# EasyEDA schematic SCH_SGU-Ring.json
TITLE: Sheet_1; REV: 1.0; Date: 2022-01-20; Sheet: 1/1; Company: Your Company
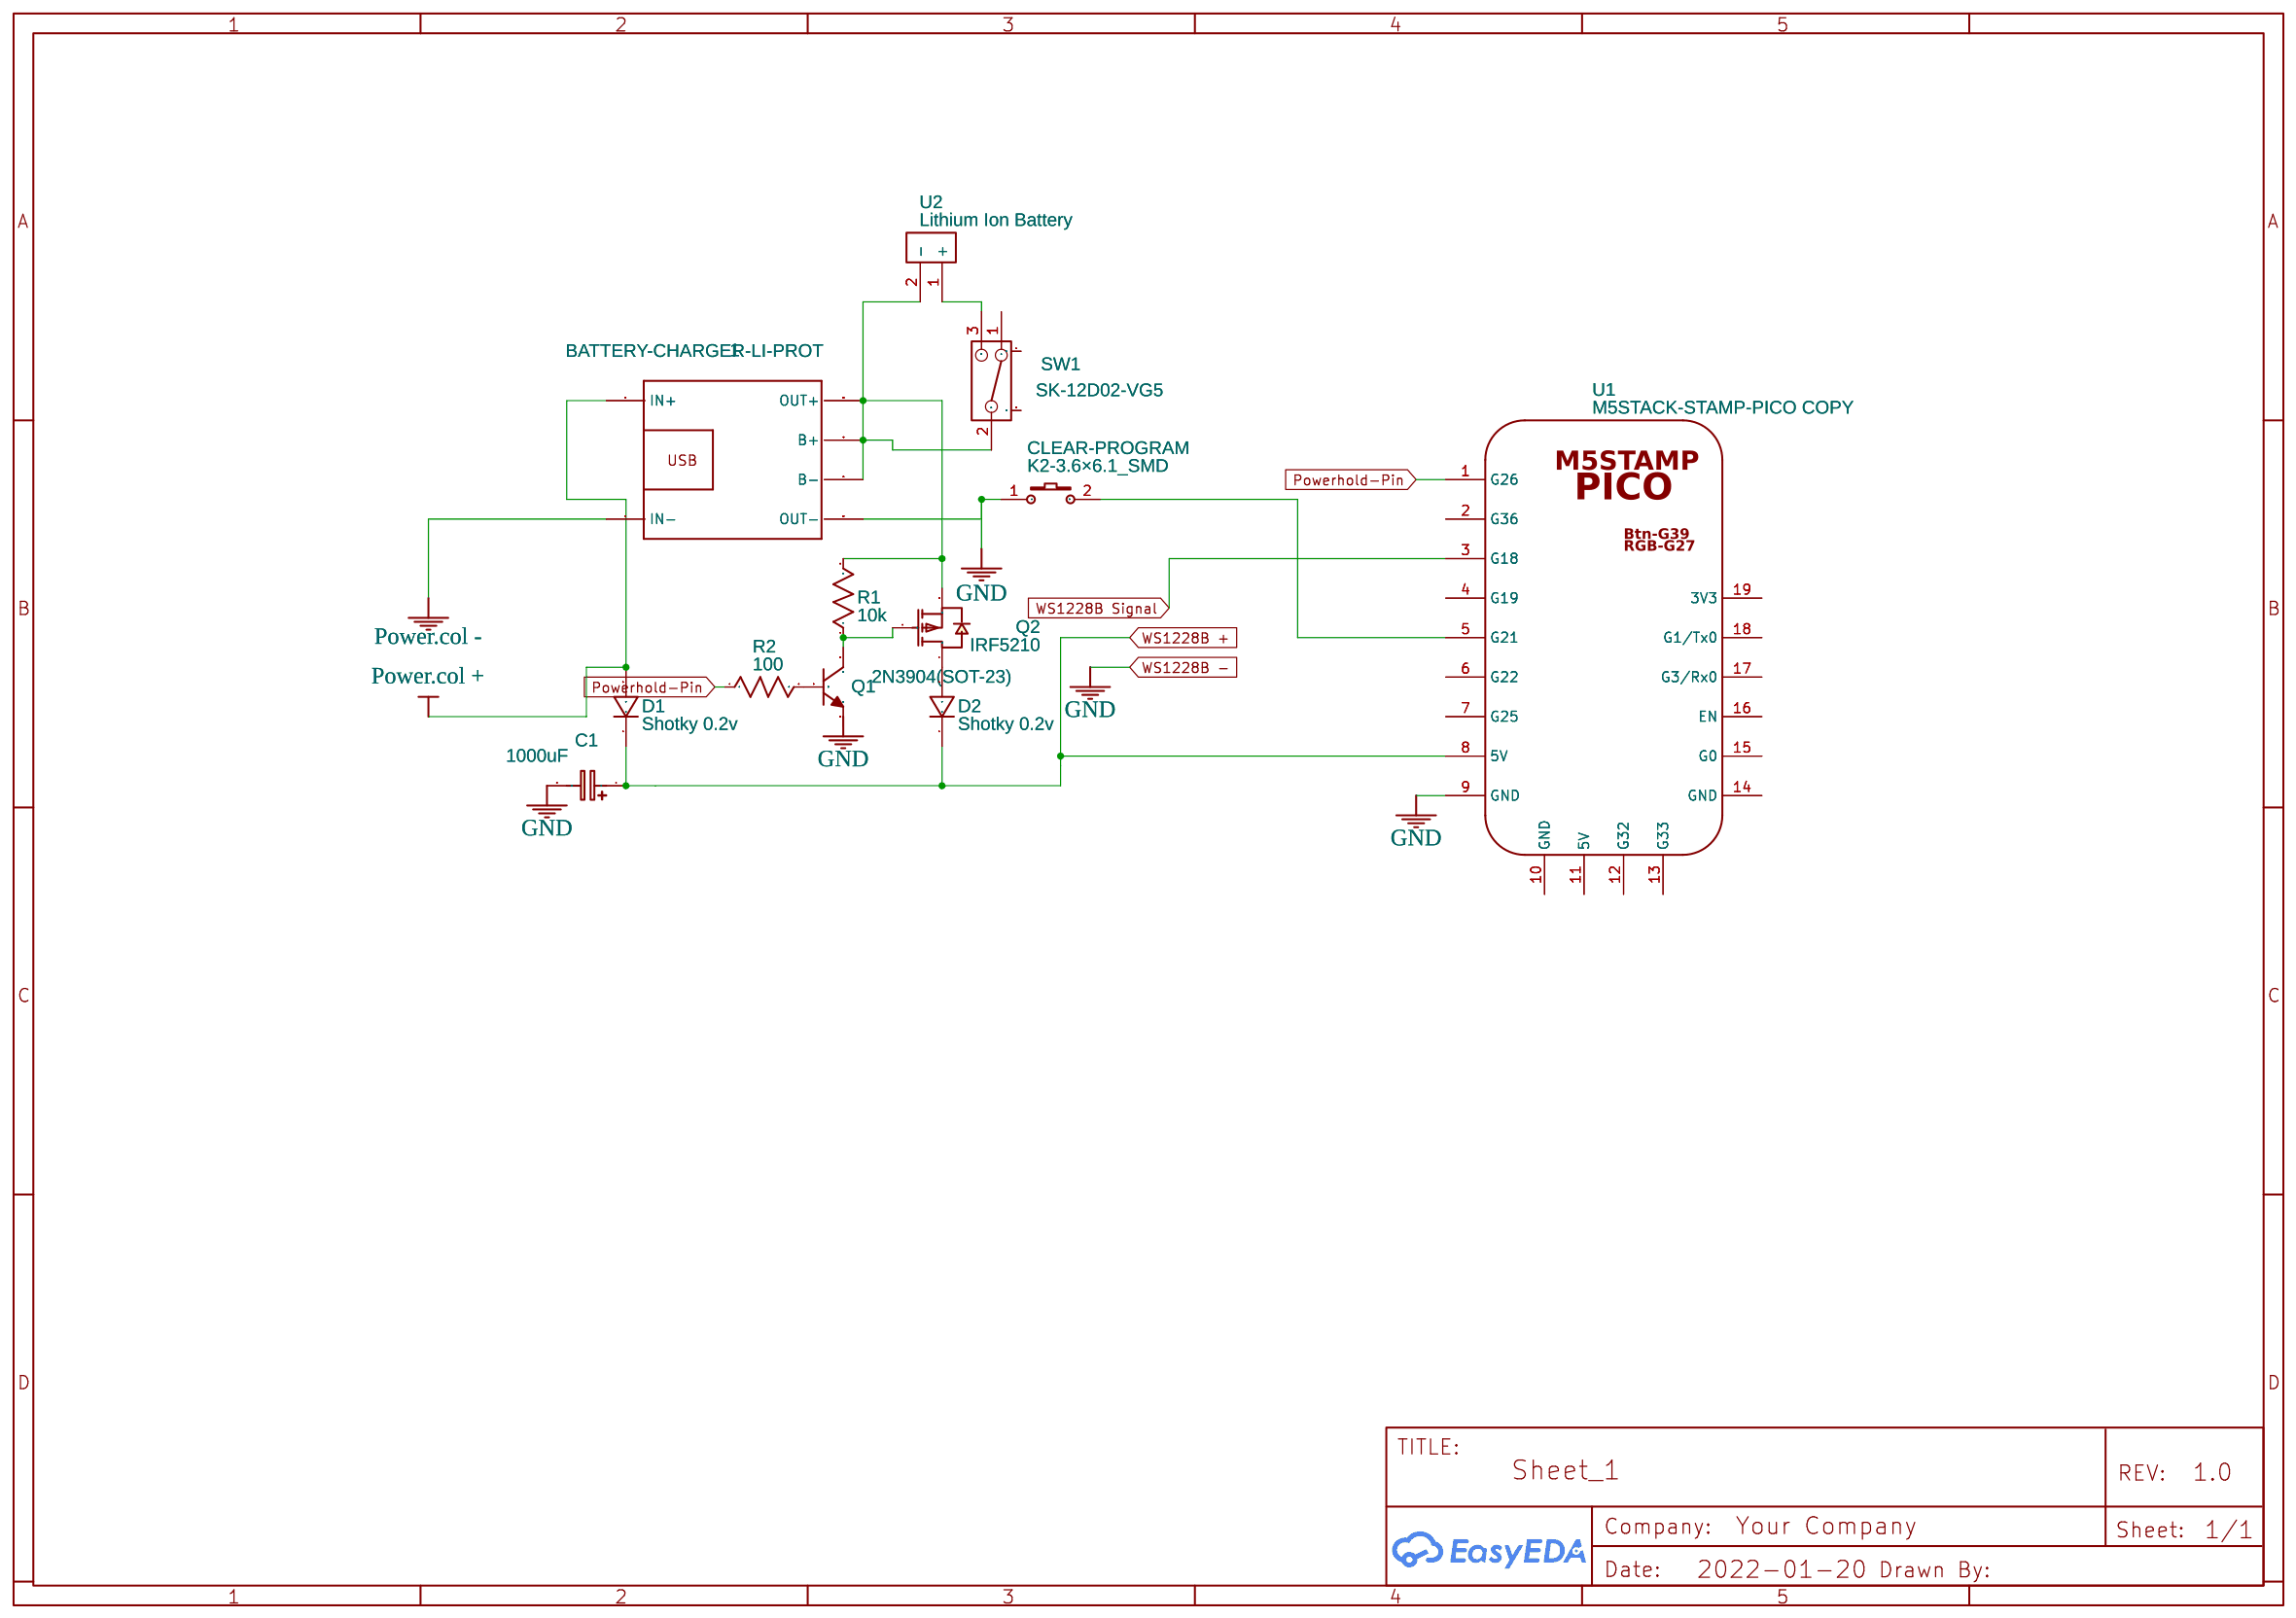
[diagram p0: schematic sheet]

## Parts
1  BATTERY-CHARGER-LI-PROT  [BATTERY-CHARGER-LI-PROT]
C1  1000uF  [CASE-A_3216]
CLEAR-PROGRAM  K2-3.6×6.1_SMD  [KEY-SMD_2P-L6.2-W3.6-LS8.0]
D1  Shotky 0.2v  [SOD-123_L2.8-W1.8-LS3.7-RD]
D2  Shotky 0.2v  [SOD-123_L2.8-W1.8-LS3.7-RD]
Q1  2N3904(SOT-23)  [SOT-23-3_L2.9-W1.3-P1.90-LS2.4-TR]
Q2  IRF5210  [TO-263-2_L10.0-W9.1-P5.08-LS15.2-BR]
R1  10k  [R0603]
R2  100  [R0603]
SW1  SK-12D02-VG5  [SW-TH_SK-12D02VG3]
U1  M5STACK-STAMP-PICO COPY  [M5STACK-STAMP-PICO]
U2  Lithium Ion Battery  [LITHIUM ION BATTERY]

## Library data of the parts
1 = BATTERY-CHARGER-LI-PROT: Contributor: moung
C1 = C_Tan_SMD_A_EU: Contributor: LCEDA_Lib
CLEAR-PROGRAM = K2-3.6×6.1_SMD: Supplier Part: C118141; Supplier: LCSC; Manufacturer Part: K2-1107ST-A4SW-06; Contributor: LCEDA_Lib; 制造商: 韩国韩荣
D1 D2 = 1N4007W: Supplier: LCSC; Supplier Part: C328592; Manufacturer: BLUE ROCKET; Contributor: LCEDA_Lib
Q1 = 2N3904(SOT-23): Supplier: LCSC; Manufacturer: KEC; Manufacturer Part: 2n3904S-RTK/PS; Supplier Part: C18536; Paste Type: SOT-23; Contributor: LCEDA_Lib
Q2 = IRF5210: Supplier: LCSC; Manufacturer: IR; Manufacturer Part: IRF5210STRLPBF; image: //image.lceda.cn/szlcsc/C2622.jpg; Supplier Part: C2622; Paste Type: expand; Contributor: LCEDA_Lib
R1 R2 = R_0603_US: Contributor: LCEDA_Lib
SW1 = SK-12D02-VG5: Supplier: LCSC; Supplier Part: C136722; Manufacturer: Rectangular Connectors - Contacts; Contributor: LCSC
U1 = M5STACK-STAMP-PICO COPY: Manufacturer: M5Stack; Contributor: Jyishit
U2 = Lithium Ion Battery: Contributor: Mariyah_M

## Nets
GND: 1.OUT- C1.2 CLEAR-PROGRAM.1 Q1.1(E) U1.9(GND)
Power.col +: 1.IN+ D1.2
Power.col -: 1.IN-
Powerhold-Pin: R2.1 U1.1(G26)
WS1228B +: C1.1 D1.1 D2.1 U1.8(5V)
WS1228B Signal: U1.3(G18)
Net-(1-B+): 1.B+ 1.B- 1.OUT+ Q2.3(S) R1.2 SW1.2 U2.2(-)
Net-(CLEAR-PROGRAM-2): CLEAR-PROGRAM.2 U1.5(G21)
Net-(D2-2): D2.2 Q2.4(D)
Net-(Q1-2): Q1.2(B) R2.2
Net-(Q1-3): Q1.3(C) Q2.1(G) R1.1
Net-(SW1-3): SW1.3 U2.1(+)

Not connected (* = marked no-connect by the designer): SW1 1 4 5; U1 2(G36) 4(G19) 6(G22) 7(G25) 10(GND) 11(5V) 12(G32) 13(G33) 14(GND) 15(G0) 16(EN) 17(G3/Rx0) 18(G1/Tx0) 19(3V3)
